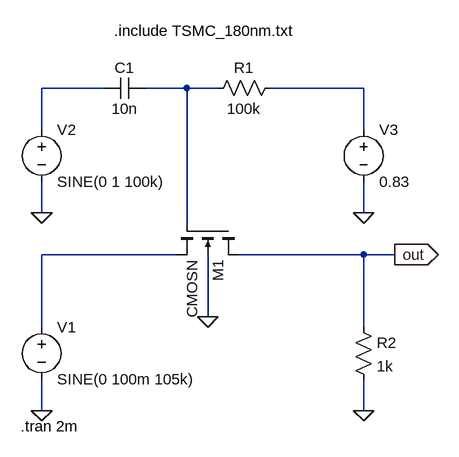
[diagram p0: schematic MIXER.asc]
MIXER.asc, the LTspice schematic file:
Version 4
SHEET 1 880 680
WIRE -208 -96 -304 -96
WIRE -80 -96 -144 -96
WIRE -32 -96 -80 -96
WIRE 192 -96 48 -96
WIRE -304 -32 -304 -96
WIRE 192 -32 192 -96
WIRE -304 96 -304 48
WIRE 192 96 192 48
WIRE -80 112 -80 -96
WIRE -96 160 -304 160
WIRE 192 160 0 160
WIRE 240 160 192 160
WIRE -48 256 -48 160
WIRE -304 272 -304 160
WIRE 192 272 192 160
WIRE -304 400 -304 352
WIRE 192 400 192 352
FLAG 192 96 0
FLAG -304 96 0
FLAG -304 400 0
FLAG 192 400 0
FLAG -48 256 0
FLAG 240 160 out
IOPIN 240 160 Out
SYMBOL nmos4 0 112 R90
SYMATTR InstName M1
SYMATTR Value CMOSN
SYMBOL voltage -304 256 R0
WINDOW 123 0 0 Left 0
WINDOW 39 0 0 Left 0
SYMATTR InstName V1
SYMATTR Value SINE(0 100m 105k)
SYMBOL voltage -304 -48 R0
WINDOW 123 0 0 Left 0
WINDOW 39 0 0 Left 0
SYMATTR InstName V2
SYMATTR Value SINE(0 1 100k)
SYMBOL cap -144 -112 R90
WINDOW 0 0 32 VBottom 2
WINDOW 3 32 32 VTop 2
SYMATTR InstName C1
SYMATTR Value 10n
SYMBOL res 64 -112 R90
WINDOW 0 0 56 VBottom 2
WINDOW 3 32 56 VTop 2
SYMATTR InstName R1
SYMATTR Value 100k
SYMBOL voltage 192 -48 R0
WINDOW 123 0 0 Left 0
WINDOW 39 0 0 Left 0
SYMATTR InstName V3
SYMATTR Value 0.83
SYMBOL res 176 256 R0
SYMATTR InstName R2
SYMATTR Value 1k
TEXT -192 -184 Left 2 !.include TSMC_180nm.txt
TEXT -336 424 Left 2 !.tran 2m

The netlist it stands for:
* MIXER.asc
M1 out N002 N004 0 CMOSN
V1 N004 0 SINE(0 100m 105k)
V2 N001 0 SINE(0 1 100k)
C1 N002 N001 10n
R1 N003 N002 100k
V3 N003 0 0.83
R2 out 0 1k
.model NMOS NMOS
.model PMOS PMOS
.lib standard.mos
.include TSMC_180nm.txt
.tran 2m
.backanno
.end